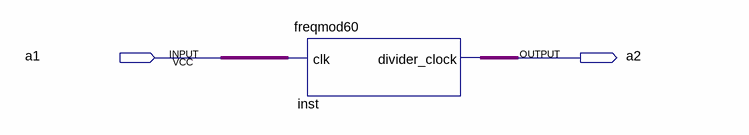
[diagram p0: schematic sheet]
// Quartus schematic freq.bdf as structural Verilog: 1 symbols, 2 pins
module freq (
  input  a1,
  output a2
);

  freqmod60 inst (.clk(a1), .divider_clock(a2));
endmodule
